# Altium project UKU208.PrjPCB
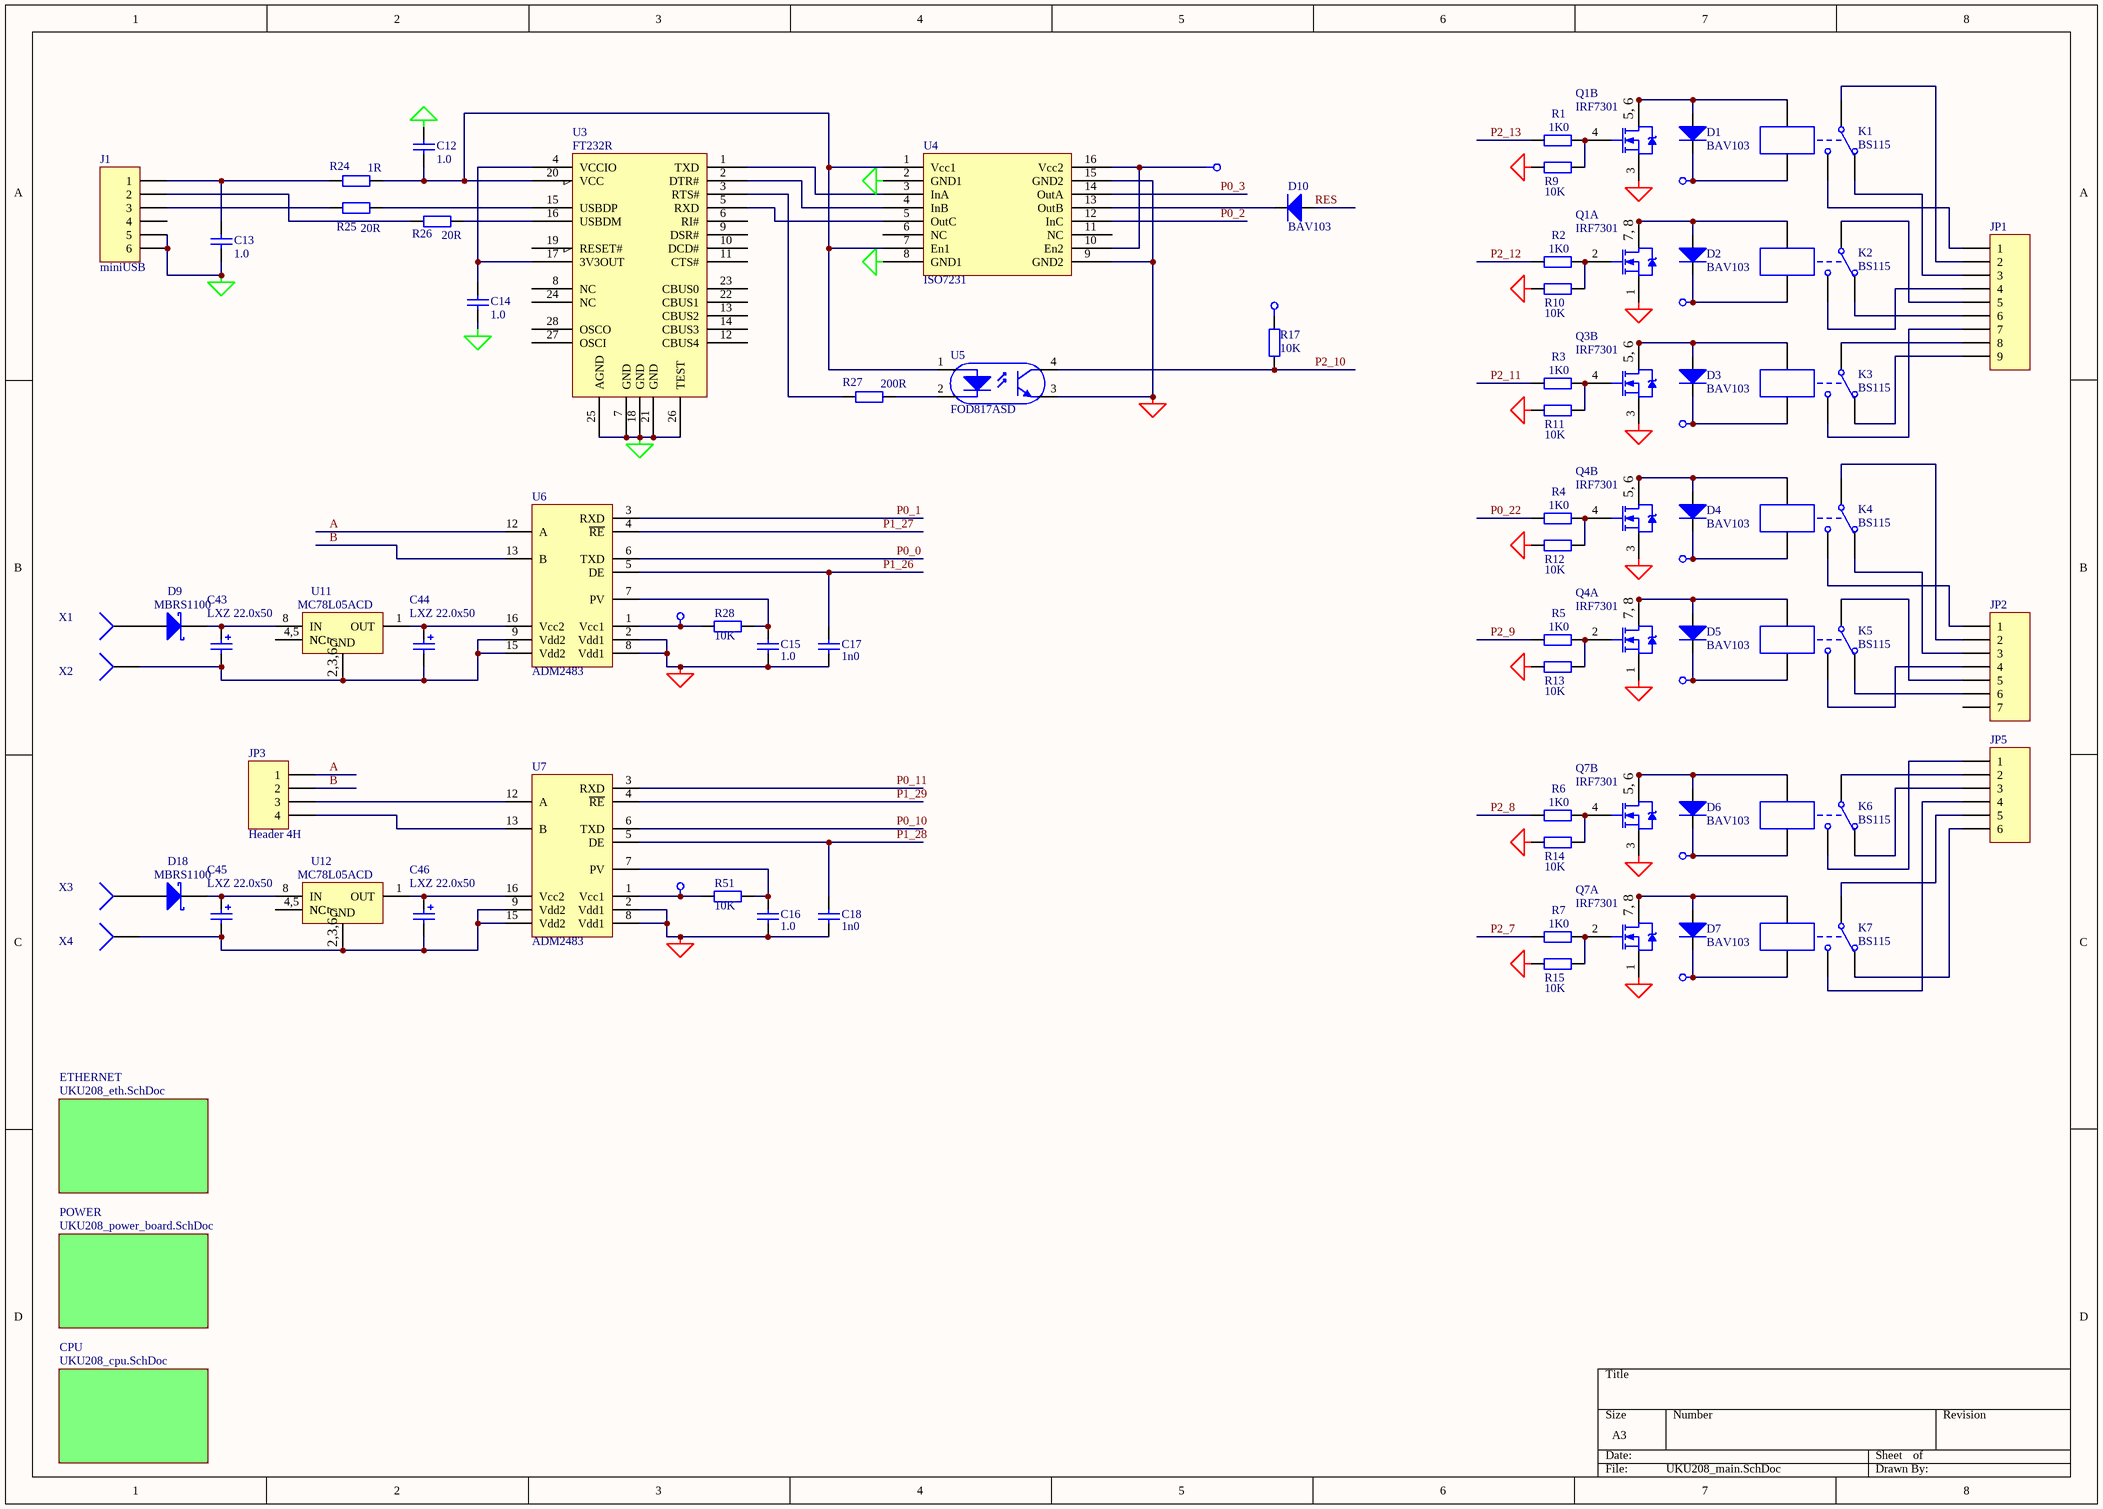
[diagram p0: UKU208_main.SchDoc]
4 sheets, 178 parts. Net scope: global (net labels, ports and power ports of the same name join across sheets).
Board file: UKU208.PcbDoc
Sheets:
  UKU208_main.SchDoc
    POWER = UKU208_power_board.SchDoc
    CPU = UKU208_cpu.SchDoc
    ETHERNET = UKU208_eth.SchDoc

## Sheet UKU208_main.SchDoc
size A3

### Parts
C12  1.0  [_1206]
C13  1.0  [_1206]
C14  1.0  [_1206]
C15  1.0  [_1206]
C16  1.0  [_1206]
C17  1n0  [_1206]
C18  1n0  [_1206]
C43  LXZ 22.0x50  [el3]
C44  LXZ 22.0x50  [el3]
C45  LXZ 22.0x50  [el3]
C46  LXZ 22.0x50  [el3]
D1  BAV103  [_1206d]
D2  BAV103  [_1206d]
D3  BAV103  [_1206d]
D4  BAV103  [_1206d]
D5  BAV103  [_1206d]
D6  BAV103  [_1206d]
D7  BAV103  [_1206d]
D9  MBRS1100  [D_6_3]
D10  BAV103  [_1206d]
D18  MBRS1100  [D_6_3]
J1  miniUSB  [USBmini]
JP1  MHDR1X9  [2EDGR-5.08-9P]  (value not drawn)
JP2  MHDR1X7  [2EDGR-5.08-7P]  (value not drawn)
JP3  Header 4H  [2EDGR-5.08-4P]
JP5  MHDR1X6  [2EDGR-5.08-6P]  (value not drawn)
K1  BS115  [bs115]
K2  BS115  [bs115]
K3  BS115  [bs115]
K4  BS115  [bs115]
K5  BS115  [bs115]
K6  BS115  [bs115]
K7  BS115  [bs115]
Q1  IRF7301  [SO-G8/Y2.2]  (parts A,B of 2)
Q3  IRF7301  [SO-G8/Y2.2]  (part B of 2)
Q4  IRF7301  [SO-G8/Y2.2]  (parts A,B of 2)
Q7  IRF7301  [SO-G8/Y2.2]  (parts A,B of 2)
R1  1K0  [_1206]
R2  1K0  [_1206]
R3  1K0  [_1206]
R4  1K0  [_1206]
R5  1K0  [_1206]
R6  1K0  [_1206]
R7  1K0  [_1206]
R9  10K  [_1206]
R10  10K  [_1206]
R11  10K  [_1206]
R12  10K  [_1206]
R13  10K  [_1206]
R14  10K  [_1206]
R15  10K  [_1206]
R17  10K  [_1206]
R24  1R  [_1206]
R25  20R  [_1206]
R26  20R  [_1206]
R27  200R  [_1206]
R28  10K  [_1206]
R51  10K  [_1206]
U3  FT232R  [SOP65P780-28L]
U4  ISO7231  [SO-G16/D10.4]
U5  FOD817ASD  [FOD817ASD]
U6  ADM2483  [SO-G16/D10.4]
U7  ADM2483  [SO-G16/D10.4]
U11  MC78L05ACD  [SO-G8]
U12  MC78L05ACD  [SO-G8]
X1  (no value)  [PIN1]
X2  (no value)  [PIN1]
X3  (no value)  [PIN1]
X4  (no value)  [PIN1]

### Sub-sheets
CPU = UKU208_cpu.SchDoc: no entries
ETHERNET = UKU208_eth.SchDoc: no entries
POWER = UKU208_power_board.SchDoc: no entries

### Nets
+3v3: R17.2
+5v: D1.2(K) D2.2(K) D3.2(K) D4.2(K) D5.2(K) D6.2(K) D7.2(K) K1.5 K2.5 K3.5 K4.5 K5.5 K6.5 K7.5 R28.1 R51.1 U4.10(En2) U4.16(Vcc2) U6.1(Vcc1) U7.1(Vcc1)
GND: C15.1 C16.1 C17.1 C18.1 Q1.1(S) Q1.3(S) Q3.3(S) Q4.1(S) Q4.3(S) Q7.1(S) Q7.3(S) R9.1 R10.1 R11.1 R12.1 R13.1 R14.1 R15.1 U4.9(GND2) U4.15(GND2) U5.3 U6.2(Vdd1) U6.8(Vdd1) U7.2(Vdd1) U7.8(Vdd1)
GND_USB: C12.1 C13.1 C14.1 J1.5 J1.6 U3.7(GND) U3.18(GND) U3.21(GND) U3.25(AGND) U3.26(TEST) U4.2(GND1) U4.8(GND1)
A: JP3.1 U6.12(A)
B: JP3.2 U6.13(B)
P0_0: U6.6(TXD)
P0_1: U6.3(RXD)
P0_2: U4.12(InC)
P0_3: U4.14(OutA)
P0_10: U7.6(TXD)
P0_11: U7.3(RXD)
P0_22: R4.1
P1_26: C17.2 U6.5(DE)
P1_27: U6.4(~{RE})
P1_28: C18.2 U7.5(DE)
P1_29: U7.4(~{RE})
P2_7: R7.1
P2_8: R6.1
P2_9: R5.1
P2_10: R17.1 U5.4
P2_11: R3.1
P2_12: R2.1
P2_13: R1.1
RES: D10.1(A)
NetC12_2: C12.2 R24.2 U3.20(VCC) U4.1(Vcc1) U4.7(En1) U5.1
NetC13_2: C13.2 J1.1 R24.1
NetC14_2: C14.2 U3.4(VCCIO) U3.17(3V3OUT)
NetC15_2: C15.2 R28.2 U6.7(PV)
NetC16_2: C16.2 R51.2 U7.7(PV)
NetC43_1: C43.1 D9.2(K) U11.8(IN)
NetC43_2: C43.2 C44.2 U6.9(Vdd2) U6.15(Vdd2) U11.2(GND) U11.3(GND) U11.6(GND) U11.7(GND) X2.1
NetC44_1: C44.1 U6.16(Vcc2) U11.1(OUT)
NetC45_1: C45.1 D18.2(K) U12.8(IN)
NetC45_2: C45.2 C46.2 U7.9(Vdd2) U7.15(Vdd2) U12.2(GND) U12.3(GND) U12.6(GND) U12.7(GND) X4.1
NetC46_1: C46.1 U7.16(Vcc2) U12.1(OUT)
NetD1_1: D1.1(A) K1.4 Q1.5(D) Q1.6(D)
NetD2_1: D2.1(A) K2.4 Q1.7(D) Q1.8(D)
NetD3_1: D3.1(A) K3.4 Q3.5(D) Q3.6(D)
NetD4_1: D4.1(A) K4.4 Q4.5(D) Q4.6(D)
NetD5_1: D5.1(A) K5.4 Q4.7(D) Q4.8(D)
NetD6_1: D6.1(A) K6.4 Q7.5(D) Q7.6(D)
NetD7_1: D7.1(A) K7.4 Q7.7(D) Q7.8(D)
NetD9_1: D9.1(A) X1.1
NetD10_2: D10.2(K) U4.13(OutB)
NetD18_1: D18.1(A) X3.1
NetJ1_2: J1.2 R26.1
NetJ1_3: J1.3 R25.1
NetJP1_1: JP1.1 K1.3
NetJP1_2: JP1.2 K1.1
NetJP1_3: JP1.3 K1.2
NetJP1_4: JP1.4 K2.3
NetJP1_5: JP1.5 K2.1
NetJP1_6: JP1.6 K2.2
NetJP1_7: JP1.7 K3.3
NetJP1_8: JP1.8 K3.1
NetJP1_9: JP1.9 K3.2
NetJP2_1: JP2.1 K4.3
NetJP2_2: JP2.2 K4.1
NetJP2_3: JP2.3 K4.2
NetJP2_4: JP2.4 K5.3
NetJP2_5: JP2.5 K5.1
NetJP2_6: JP2.6 K5.2
NetJP3_3: JP3.3 U7.12(A)
NetJP3_4: JP3.4 U7.13(B)
NetJP5_1: JP5.1 K6.3
NetJP5_2: JP5.2 K6.1
NetJP5_3: JP5.3 K6.2
NetJP5_4: JP5.4 K7.3
NetJP5_5: JP5.5 K7.1
NetJP5_6: JP5.6 K7.2
NetQ1_2: Q1.2(G) R2.2 R10.2
NetQ1_4: Q1.4(G) R1.2 R9.2
NetQ3_4: Q3.4(G) R3.2 R11.2
NetQ4_2: Q4.2(G) R5.2 R13.2
NetQ4_4: Q4.4(G) R4.2 R12.2
NetQ7_2: Q7.2(G) R7.2 R15.2
NetQ7_4: Q7.4(G) R6.2 R14.2
NetR25_2: R25.2 U3.15(USBDP)
NetR26_2: R26.2 U3.16(USBDM)
NetR27_1: R27.1 U3.3(RTS#)
NetR27_2: R27.2 U5.2
NetU3_1: U3.1(TXD) U4.3(InA)
NetU3_2: U3.2(DTR#) U4.4(InB)
NetU3_5: U3.5(RXD) U4.5(OutC)
NetU11_4: U11.4(NC) U11.5(NC)
NetU12_4: U12.4(NC) U12.5(NC)

Not connected (* = marked no-connect by the designer): J1 4; JP2 7; U3 6(RI#) 8(NC) 9(DSR#) 10(DCD#) 11(CTS#) 12(CBUS4) 13(CBUS2) 14(CBUS3) 19(RESET#) 22(CBUS1) 23(CBUS0) 24(NC) 27(OSCI) 28(OSCO); U4 6(NC) 11(NC)

### Notes on the sheet
- (in symbol IRF7301, part A) 7, 8
- (in symbol IRF7301, part B) 5, 6
- (in symbol MC78L05ACD) 4,5; 2,3,6,7

### Library data of the parts
C12-C18 = Cap Semi: Capacitor (Semiconductor SIM Model); Manufacturer: Generic Components; Class I: Passive; Value: 1,0; Published: 8-Jun-2000; Revision: July-2002: Re-released for DXP Platform.; Publisher: Altium Limited; Class II: Capacitor
C43-C46 = Cap Pol1: Polarized Capacitor (Radial); Manufacturer: Generic Components; Class I: Passive; Value: 22,0x50; Published: 8-Jun-2000; Revision: July-2002: Re-released for DXP Platform.; Publisher: Altium Limited; Class II: Capacitor
D1-D7 D10 = Diode: Manufacturer: Generic Components; Class I: Discrete; Class II: Diode - Switching; Value: LL4148; Published: 8-Jun-2000; Revision: July-2002: Re-released for DXP Platform.; Publisher: Altium Limited
D9 D18 = 10BQ015: Schottky Rectifier; Manufacturer: International Rectifier; Revision 1: 10-July-2000: SIM Model Added.; Revision 2: July-2002: Re-released for DXP Platform.; Class I: Discrete; Class II: Rectifier - Schottky; Published: 8-Jun-2000; Datasheet: Latest Revision: PD-2.396A; Package Reference: DO-214AA; Publisher: Altium Limited
J1 = Header 6: Header, 6-Pin; Value: USB-B; LatestRevisionDate: 17-Jul-2002; LatestRevisionNote: Re-released for DXP Platform.; Publisher: Altium Limited
JP1 = MHDR1X9: Header, 9-Pin; Manufacturer: Generic Components; Class I: Connector; Revision: July-2002: Re-released for DXP Platform.; Publisher: Altium Limited
JP2 = MHDR1X7: Header, 7-Pin; Manufacturer: Generic Components; Class I: Connector; Revision: July-2002: Re-released for DXP Platform.; Publisher: Altium Limited
JP3 = Header 4H: Header, 4-Pin,  Right Angle; Manufacturer: Generic Components; Class I: Connector; Revision: July-2002: Re-released for DXP Platform.; Publisher: Altium Limited
JP5 = MHDR1X6: Header, 6-Pin; Manufacturer: Generic Components; Class I: Connector; Revision: July-2002: Re-released for DXP Platform.; Publisher: Altium Limited
K1-K7 = BS115: Single-Pole Dual-Throw Relay; Manufacturer: Generic Components; Class I: Electro-mechanical; Published: 24-Mar-1999; Revision: July-2002: Re-released for DXP Platform.; Publisher: Altium Limited; Class II: Relay
Q1 Q3 Q4 Q7 = IRF7301: FET; Manufacturer: International Rectifier; Revision 1: 29-Sep-2000: Re-orientated a 'Drain' pin on first part.; Revision 2: July-2002: Re-released for DXP Platform.; Class I: Discrete; Class II: MOSFET - Power; Value: IRF7103; Published: 8-Jun-2000; Datasheet: Latest Revision: Aug-1997; Package Reference: SOIC8; Publisher: Altium Limited
R1-R7 = Res2: Resistor; Manufacturer: Generic Components; Class I: Passive; Rule: Undefined; Published: 8-Jun-2000; Revision: July-2002: Re-released for DXP Platform.; Publisher: Altium Limited; Class II: Resistor; Value: 1K0
R9-R15 = Res2: Resistor; Manufacturer: Generic Components; Class I: Passive; Published: 8-Jun-2000; Revision: July-2002: Re-released for DXP Platform.; Publisher: Altium Limited; Class II: Resistor; Value: 10K
R17 R28 R51 = Res2: Resistor; Manufacturer: Generic Components; Class I: Passive; Value: 1K0; Rule: Undefined; Published: 8-Jun-2000; Revision: July-2002: Re-released for DXP Platform.; Publisher: Altium Limited; Class II: Resistor
R24-R27 = RES: Body: 0603; Value: 22R; Type: S; Pins: 2
U3 = FT232R: Body: SSOP28LD; Value: FT232RL; Type: S; Pins: 20
U5 = F00817ASD
U11 U12 = MC78L05ACD: 3-Terminal Low-Current Positive Fixed Voltage Regulator; Manufacturer: Motorola; Class I: Power Management; Published: 15-Apr-2002; Datasheet: Linear and Interface Integrated Circuits, DL128 Rev2 (1988); Package Reference: 751-02; Publisher: Altium Limited; Class II: Voltage Regulator
X1-X4 = Socket: Manufacturer: Generic Components; Class I: Connector; Revision: July-2002: Re-released for DXP Platform.; Publisher: Altium Limited

## Sheet UKU208_power_board.SchDoc
size A3
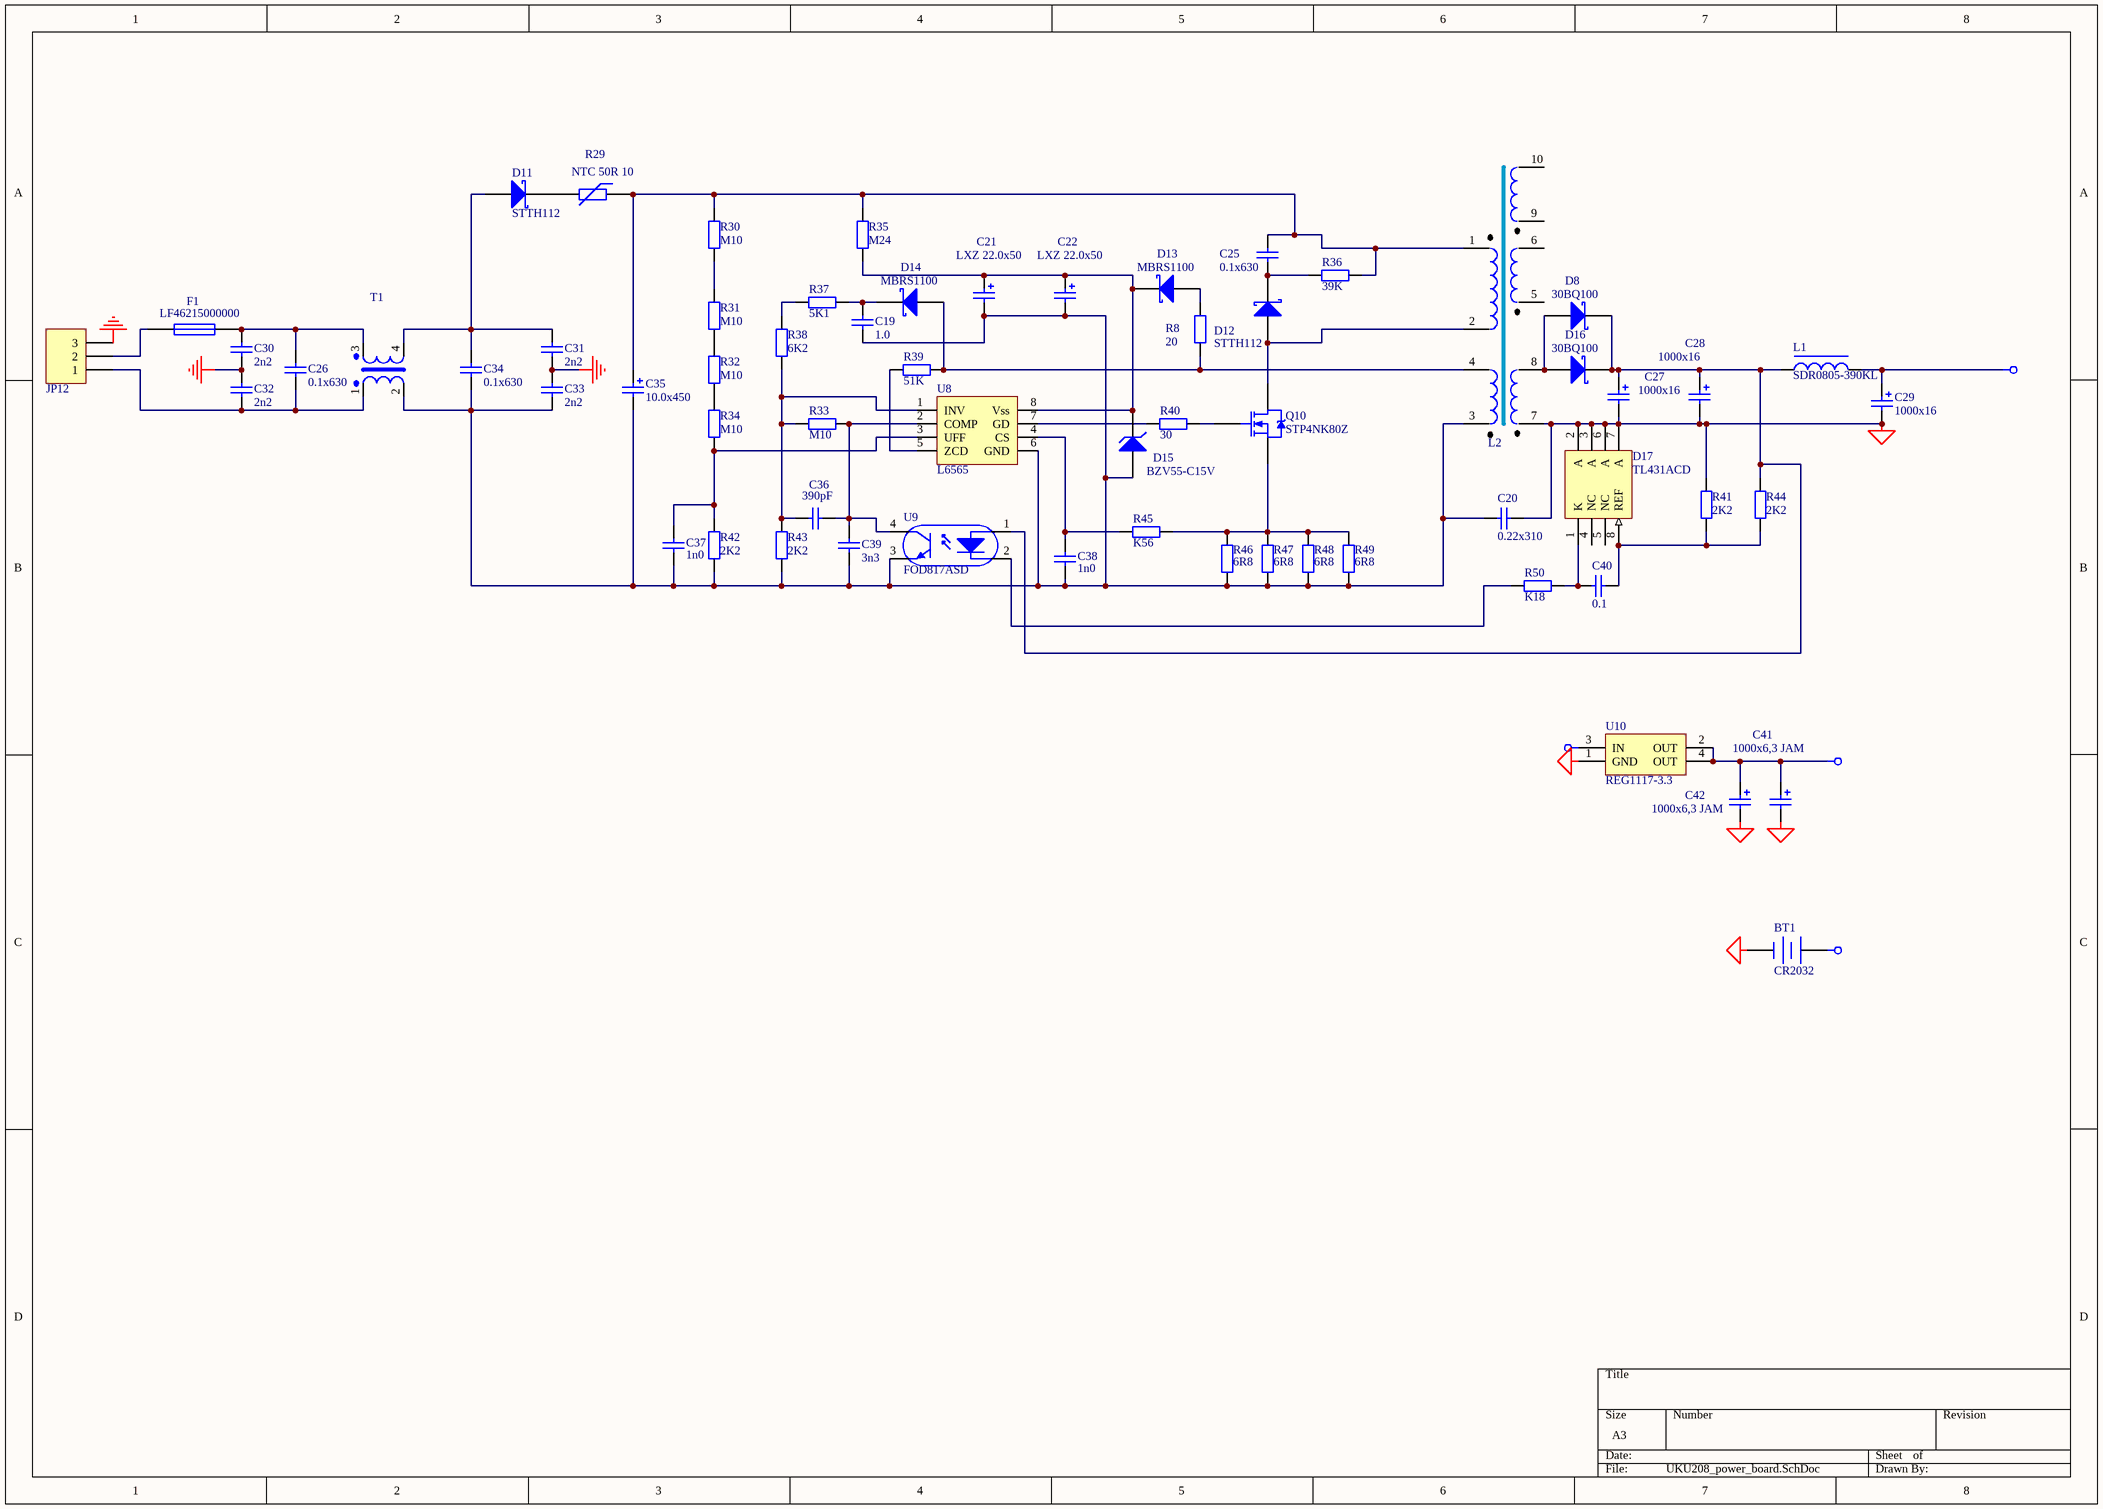
[diagram p1: UKU208_power_board.SchDoc]

### Parts
BT1  CR2032  [BAT_SUPP]
C19  1.0  [_1206]
C20  0.22x310  [C8]
C21  LXZ 22.0x50  [el3]
C22  LXZ 22.0x50  [el3]
C25  0.1x630  [c15]
C26  0.1x630  [c15]
C27  1000x16  [el5]
C28  1000x16  [el5]
C29  1000x16  [el5]
C30  2n2  [C8]
C31  2n2  [c8]
C32  2n2  [c8]
C33  2n2  [c8]
C34  0.1x630  [c15]
C35  10.0x450  [el_15_25_h]
C36  390pF  [_1206]
C37  1n0  [_1206]
C38  1n0  [_1206]
C39  3n3  [_1206]
C40  0.1  [_1206]
C41  1000x6,3 JAM  [el3]
C42  1000x6,3 JAM  [el3]
D8  30BQ100  [30BQ100]
D11  STTH112  [D_6_3]
D12  STTH112  [D_6_3]
D13  MBRS1100  [D_6_3]
D14  MBRS1100  [D_6_3]
D15  BZV55-C15V  [_1206d]
D16  30BQ100  [30BQ100]
D17  TL431ACD  [SO-G8]
F1  LF46215000000  [LF462]
JP12  Header 3  [2EDGR-5.08-3P]  (value not drawn)
L1  SDR0805-390KL  [L10x10]
L2  L220-K10  [trans_ring1]  (value not drawn)
Q10  STP4NK80Z  [TO220_h]
R8  20  [_1206]
R29  NTC 50R 10  [JVR07N]
R30  M10  [_1206]
R31  M10  [_1206]
R32  M10  [_1206]
R33  M10  [_1206]
R34  M10  [_1206]
R35  M24  [AXIAL-0.7]
R36  39K  [AXIAL-0.7]
R37  5K1  [_1206]
R38  6K2  [_1206]
R39  51K  [_1206]
R40  30  [_1206]
R41  2K2  [_1206]
R42  2K2  [_1206]
R43  2K2  [_1206]
R44  2K2  [_1206]
R45  K56  [_1206]
R46  6R8  [_1206]
R47  6R8  [_1206]
R48  6R8  [_1206]
R49  6R8  [_1206]
R50  K18  [_1206]
T1  TRANS1_1  [3030R4]  (value not drawn)
U8  L6565  [so-g8]
U9  FOD817ASD  [FOD817ASD]
U10  REG1117-3.3  [DSO-G3]

### Nets
+3v3: C41.1 C42.1 U10.2(OUT) U10.4(OUT)
+5v: C29.1 L1.2 U10.3(IN)
+Vbat: BT1.1(+)
GND: BT1.2(-) C20.1 C27.2 C28.2 C29.2 C41.2 C42.2 D17.2(A) D17.3(A) D17.6(A) D17.7(A) L2.7 R41.2 U10.1(GND)
GND_GND: C30.1 C31.1 C32.2 C33.2 JP12.3
NetC19_1: C19.1 C20.2 C21.2 C22.2 C33.1 C34.1 C35.2 C37.2 C38.2 C39.1 D15.1(A) L2.3 R42.1 R43.1 R46.2 R47.2 R48.2 R49.2 T1.2(Pri-) U8.6(GND) U9.3
NetC19_2: C19.2 D14.2(K) R37.1
NetC21_1: C21.1 C22.1 D13.2(K) D15.2(K) R35.1 U8.8(Vss)
NetC25_1: C25.1 D12.2(K) R36.2
NetC25_2: C25.2 C35.1 L2.1 R29.1 R30.2 R35.2 R36.1
NetC26_1: C26.1 C32.1 JP12.1 T1.1(Pri+)
NetC26_2: C26.2 C30.2 F1.1 T1.3(Sec1+)
NetC27_1: C27.1 C28.1 D8.2(K) D16.2(K) L1.1 R44.1 U9.1
NetC31_2: C31.2 C34.2 D11.1(A) T1.4(Sec1-)
NetC36_1: C36.1 R33.2 R38.1 R43.2 U8.1(INV)
NetC36_2: C36.2 C39.2 R33.1 U8.2(COMP) U9.4
NetC37_1: C37.1 R34.1 R42.2 U8.3(UFF)
NetC38_1: C38.1 R45.2 U8.4(CS)
NetC40_1: C40.1 D17.8(REF) R41.1 R44.2
NetC40_2: C40.2 D17.1(K) R50.1
NetD8_1: D8.1(A) D16.1(A) L2.8
NetD11_2: D11.2(K) R29.2
NetD12_1: D12.1(A) L2.2 Q10.2(D)
NetD13_1: D13.1(A) R8.1
NetD14_1: D14.1(A) L2.4 R8.2 R39.1
NetF1_2: F1.2 JP12.2
NetQ10_1: Q10.1(G) R40.1
NetQ10_3: Q10.3(S) R45.1 R46.1 R47.1 R48.1 R49.1
NetR30_1: R30.1 R31.2
NetR31_1: R31.1 R32.2
NetR32_1: R32.1 R34.2
NetR37_2: R37.2 R38.2
NetR39_2: R39.2 U8.5(ZCD)
NetR40_2: R40.2 U8.7(GD)
NetR50_2: R50.2 U9.2

Not connected (* = marked no-connect by the designer): D17 4(NC) 5(NC); L2 5 6 9 10

### Library data of the parts
BT1 = Battery: Multicell Battery; Manufacturer: Generic Components; Published: 24-Mar-1999; Revision: July-2002: Re-released for DXP Platform.; Publisher: Altium Limited
C19 C20 C25 C26 C30-C34 C36-C40 = Cap Semi: as C12 on sheet UKU208_main; Published: 8-Jun-2000; Revision: July-2002: Re-released for DXP Platform.; Publisher: Altium Limited; Class II: Capacitor
C21 C22 C27-C29 C35 C41 C42 = Cap Pol1: as C43 on sheet UKU208_main; Published: 8-Jun-2000; Revision: July-2002: Re-released for DXP Platform.; Publisher: Altium Limited; Class II: Capacitor
D8 D13 D14 D16 = 10BQ015: as D9 on sheet UKU208_main; Published: 8-Jun-2000; Datasheet: Latest Revision: PD-2.396A; Package Reference: DO-214AA; Publisher: Altium Limited
D11 D12 = 10BQ015: Schottky Diode; Manufacturer: International Rectifier; Revision 1: 10-July-2000: SIM Model Added.; Revision 2: July-2002: Re-released for DXP Platform.; Class I: Discrete; Class II: Rectifier - Schottky; Value: 10BQ100; Published: 8-Jun-2000; Datasheet: Latest Revision: PD-2.396A; Package Reference: DO-214AA; Publisher: Altium Limited
D15 = D Zener: Zener Diode; Manufacturer: Generic Components; Class I: Discrete; Class II: Diode - Zener; Value: BZV55C5V6; Published: 8-Jun-2000; Revision: July-2002: Re-released for DXP Platform.; Publisher: Altium Limited
D17 = TL431ACD: Programmable Precision Reference; Manufacturer: Motorola; Class I: Power Management; Class II: Voltage Reference; Published: 15-Apr-2002; Datasheet: Linear and Interface Integrated Circuits, DL128 Rev2 (1988); Package Reference: 751-02; Publisher: Altium Limited
F1 = Fuse 1: Fuse; Manufacturer: Generic Components; Class I: Passive; Published: 8-Jun-2000; Revision: July-2002: Re-released for DXP Platform.; Publisher: Altium Limited; Class II: Fuse
JP12 = Header 3: Header, 3-Pin; Manufacturer: Generic Components; Class I: Connector; Revision: July-2002: Re-released for DXP Platform.; Publisher: Altium Limited
L1 = Inductor Konstr 2: Magnetic-Core Inductor; Manufacturer: Generic Components; Class I: Passive; Published: 24-Mar-1999; Revision: July-2002: Re-released for DXP Platform.; Publisher: Altium Limited; Class II: Inductor
L2 = L1_dc_2: Дроссель
Q10 = NMOS-2: N-Channel Power MOSFET; Manufacturer: Generic Components; Class I: Discrete; Class II: MOSFET - Power; Note: Pin 2 is electrically connected to pin 4.; Published: 8-Jun-2000; Revision: July-2002: Re-released for DXP Platform.; Datasheet: Latest Revision: PD-9.814; Package Reference: TO-220AB; Publisher: Altium Limited
R8 R30-R50 = Res2: as R17 on sheet UKU208_main; Published: 8-Jun-2000; Revision: July-2002: Re-released for DXP Platform.; Publisher: Altium Limited; Class II: Resistor
R29 = Res Varistor: Varistor (Voltage-Sensitive Resistor); Manufacturer: Generic Components; Class I: Discrete; Published: 24-Mar-1999; Revision: July-2002: Re-released for DXP Platform.; Publisher: Altium Limited; Class II: Voltage-Sensitive Resistor
T1 = TRANS1_1: Manufacturer: Generic Components; Class I: Passive; Class II: Transformer; Published: 25-Jan-2001; Revision: July-2002: Re-released for DXP Platform.; Publisher: Altium Limited
U9 = F00817ASD
U10 = REG1117-3.3: 800mA and 1A Low Dropout Positive Regulator 2.85V, 3.3V, 5V, and Adjustable; Manufacturer: Burr-Brown; Package Information: Latest Revision: Rev. C; Class I: Power Management; Class II: Voltage Regulator; Published: 8-Jun-2000; Revision: July-2002: Re-released for DXP Platform.; Datasheet: Latest Revision: Sep-1997; Package Reference: ZZ311; Publisher: Altium Limited

## Sheet UKU208_cpu.SchDoc
size A3
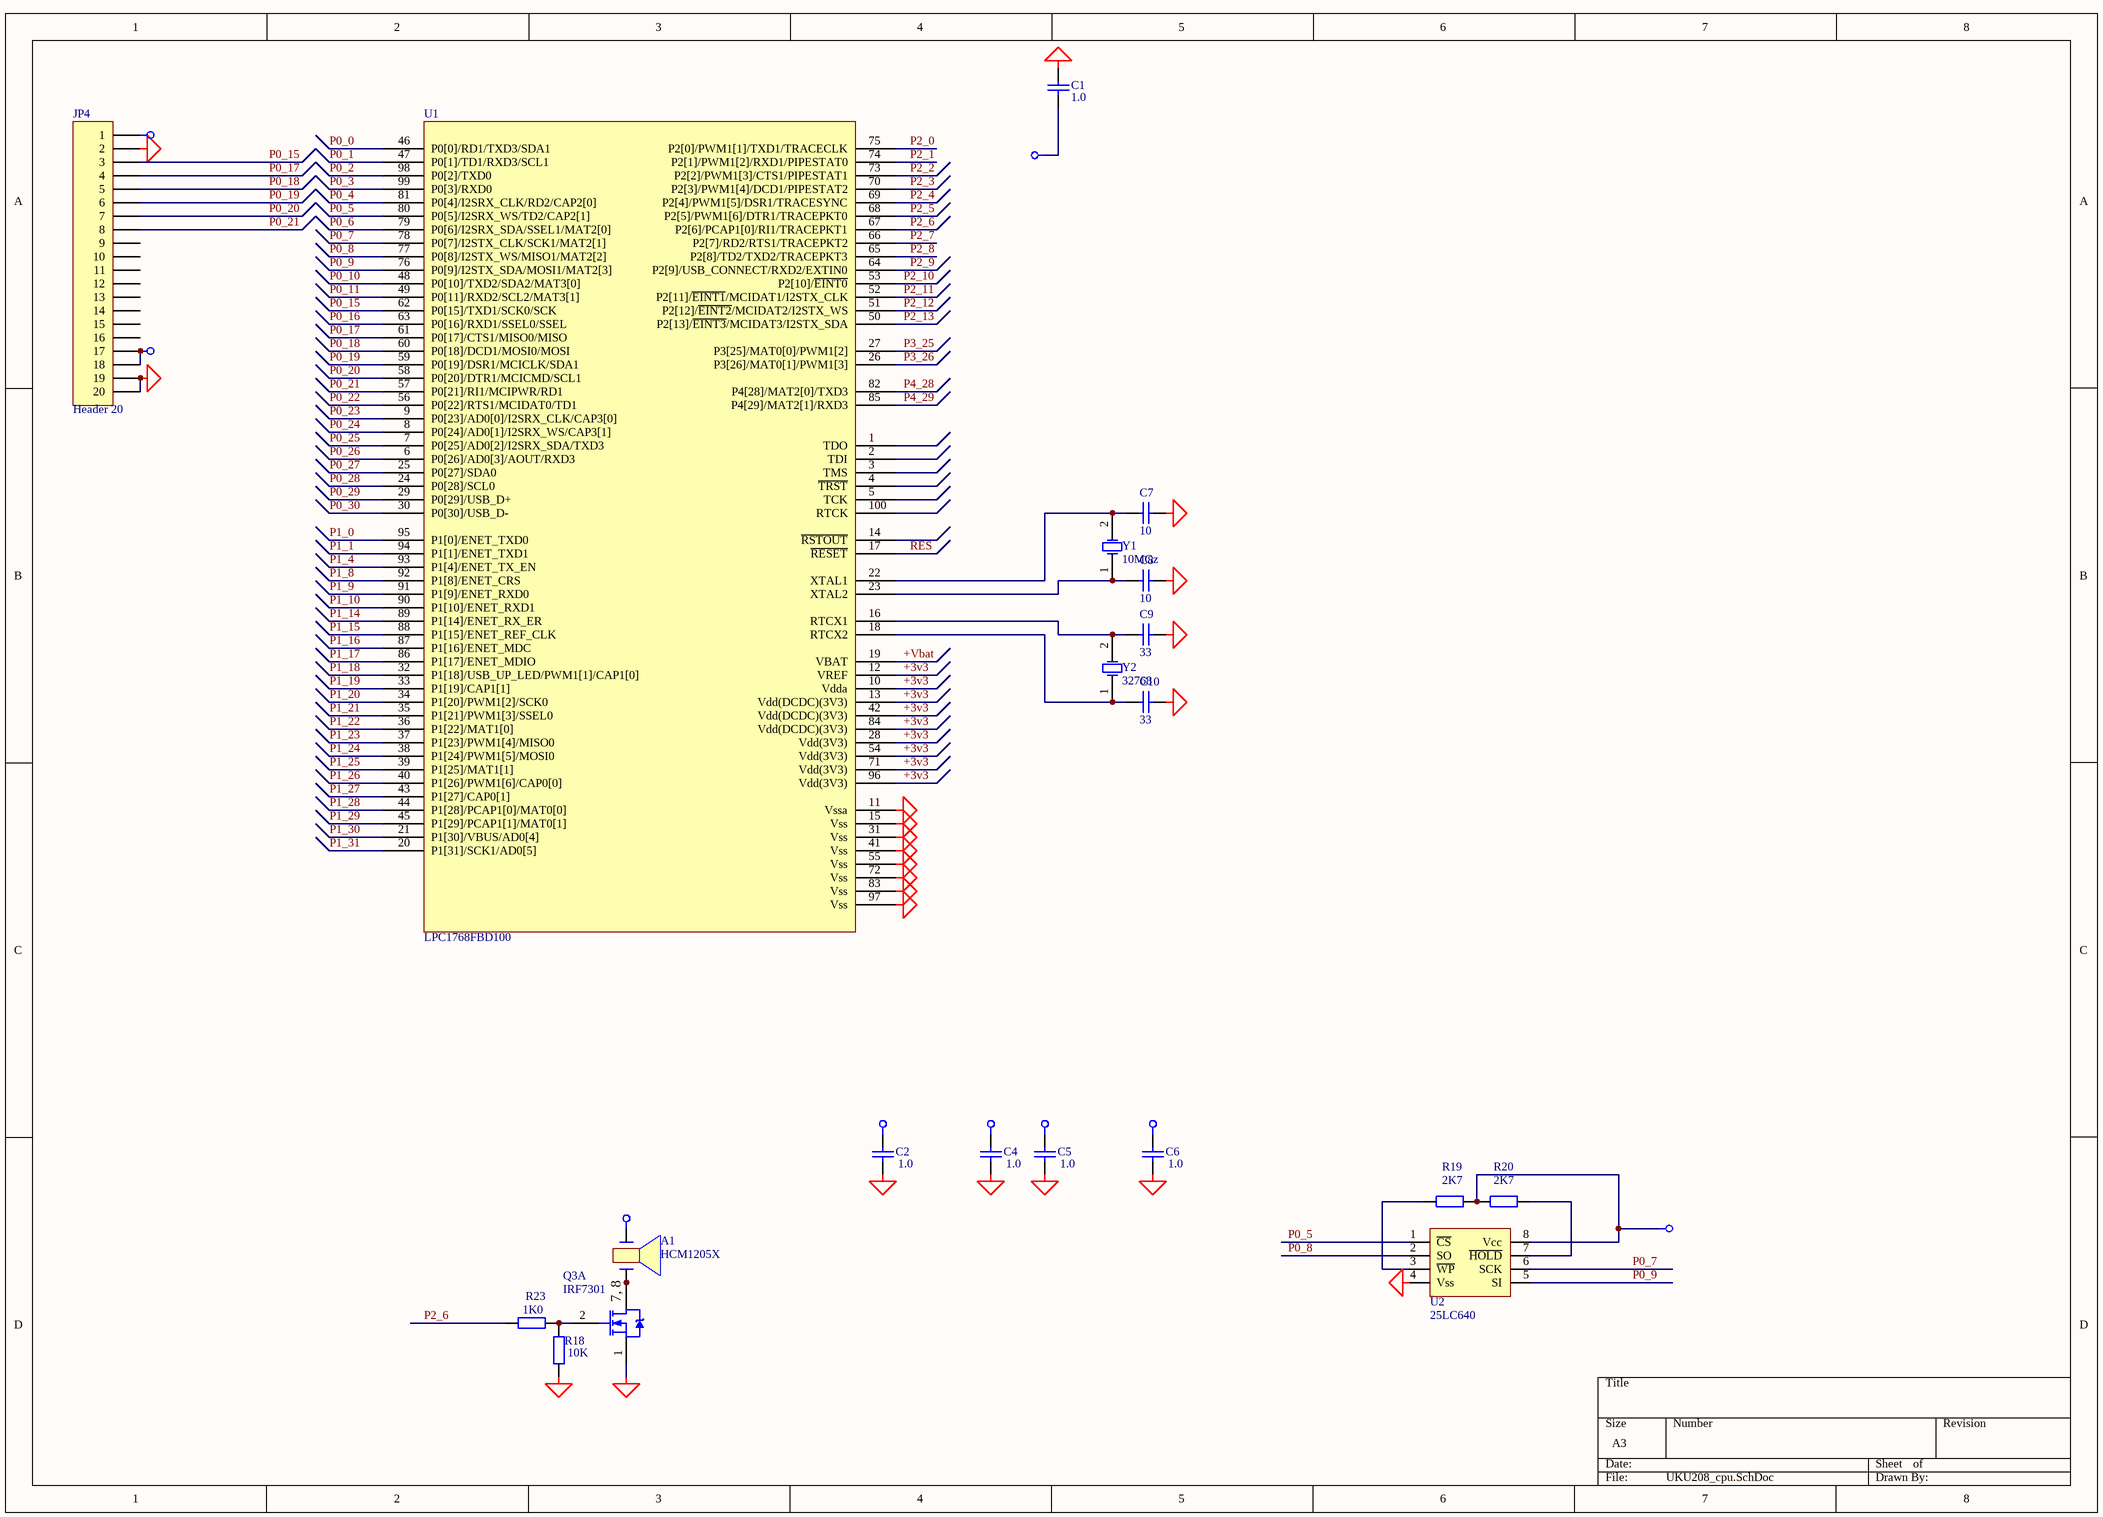
[diagram p2: UKU208_cpu.SchDoc]

### Parts
A1  HCM1205X  [zumm]
C1  1.0  [_1206]
C2  1.0  [_1206]
C4  1.0  [_1206]
C5  1.0  [_1206]
C6  1.0  [_1206]
C7  10  [_1206]
C8  10  [_1206]
C9  33  [_1206]
C10  33  [_1206]
JP4  Header 20  [XF2M20151A]
Q3  IRF7301  [SO-G8/Y2.2]  (part A of 2)
R18  10K  [_1206]
R19  2K7  [_1206]
R20  2K7  [_1206]
R23  1K0  [_1206]
U1  LPC1768FBD100  [LPC2368]
U2  25LC640  [SO-G8/D5]
Y1  10MGz  [QWARZ1]
Y2  32768  [QWARZ2]

### Nets
+3v3: C1.1 C5.2 JP4.1 U1.10(Vdda) U1.12(VREF) U1.13(Vdd(DCDC)(3V3)) U1.28(Vdd(3V3)) U1.42(Vdd(DCDC)(3V3)) U1.54(Vdd(3V3)) U1.71(Vdd(3V3)) U1.84(Vdd(DCDC)(3V3)) U1.96(Vdd(3V3))
+5v: A1.1 C2.2 C4.2 C6.2 JP4.17 JP4.18 R19.2 R20.1 U2.8(Vcc)
+Vbat: U1.19(VBAT)
GND: C1.2 C2.1 C4.1 C5.1 C6.1 C7.1 C8.1 C9.1 C10.1 JP4.2 JP4.19 JP4.20 Q3.1(S) R18.1 U1.11(Vssa) U1.15(Vss) U1.31(Vss) U1.41(Vss) U1.55(Vss) U1.72(Vss) U1.83(Vss) U1.97(Vss) U2.4(Vss)
P0_0: U1.46(P0[0]/RD1/TXD3/SDA1)
P0_1: U1.47(P0[1]/TD1/RXD3/SCL1)
P0_2: U1.98(P0[2]/TXD0)
P0_3: U1.99(P0[3]/RXD0)
P0_4: U1.81(P0[4]/I2SRX_CLK/RD2/CAP2[0])
P0_5: U1.80(P0[5]/I2SRX_WS/TD2/CAP2[1]) U2.1(~{CS})
P0_6: U1.79(P0[6]/I2SRX_SDA/SSEL1/MAT2[0])
P0_7: U1.78(P0[7]/I2STX_CLK/SCK1/MAT2[1]) U2.6(SCK)
P0_8: U1.77(P0[8]/I2STX_WS/MISO1/MAT2[2]) U2.2(SO)
P0_9: U1.76(P0[9]/I2STX_SDA/MOSI1/MAT2[3]) U2.5(SI)
P0_10: U1.48(P0[10]/TXD2/SDA2/MAT3[0])
P0_11: U1.49(P0[11]/RXD2/SCL2/MAT3[1])
P0_15: JP4.3 U1.62(P0[15]/TXD1/SCK0/SCK)
P0_16: U1.63(P0[16]/RXD1/SSEL0/SSEL)
P0_17: JP4.4 U1.61(P0[17]/CTS1/MISO0/MISO)
P0_18: JP4.5 U1.60(P0[18]/DCD1/MOSI0/MOSI)
P0_19: JP4.6 U1.59(P0[19]/DSR1/MCICLK/SDA1)
P0_20: JP4.7 U1.58(P0[20]/DTR1/MCICMD/SCL1)
P0_21: JP4.8 U1.57(P0[21]/RI1/MCIPWR/RD1)
P0_22: U1.56(P0[22]/RTS1/MCIDAT0/TD1)
P0_23: U1.9(P0[23]/AD0[0]/I2SRX_CLK/CAP3[0])
P0_24: U1.8(P0[24]/AD0[1]/I2SRX_WS/CAP3[1])
P0_25: U1.7(P0[25]/AD0[2]/I2SRX_SDA/TXD3)
P0_26: U1.6(P0[26]/AD0[3]/AOUT/RXD3)
P0_27: U1.25(P0[27]/SDA0)
P0_28: U1.24(P0[28]/SCL0)
P0_29: U1.29(P0[29]/USB_D+)
P0_30: U1.30(P0[30]/USB_D-)
P1_0: U1.95(P1[0]/ENET_TXD0)
P1_1: U1.94(P1[1]/ENET_TXD1)
P1_4: U1.93(P1[4]/ENET_TX_EN)
P1_8: U1.92(P1[8]/ENET_CRS)
P1_9: U1.91(P1[9]/ENET_RXD0)
P1_10: U1.90(P1[10]/ENET_RXD1)
P1_14: U1.89(P1[14]/ENET_RX_ER)
P1_15: U1.88(P1[15]/ENET_REF_CLK)
P1_16: U1.87(P1[16]/ENET_MDC)
P1_17: U1.86(P1[17]/ENET_MDIO)
P1_18: U1.32(P1[18]/USB_UP_LED/PWM1[1]/CAP1[0])
P1_19: U1.33(P1[19]/CAP1[1])
P1_20: U1.34(P1[20]/PWM1[2]/SCK0)
P1_21: U1.35(P1[21]/PWM1[3]/SSEL0)
P1_22: U1.36(P1[22]/MAT1[0])
P1_23: U1.37(P1[23]/PWM1[4]/MISO0)
P1_24: U1.38(P1[24]/PWM1[5]/MOSI0)
P1_25: U1.39(P1[25]/MAT1[1])
P1_26: U1.40(P1[26]/PWM1[6]/CAP0[0])
P1_27: U1.43(P1[27]/CAP0[1])
P1_28: U1.44(P1[28]/PCAP1[0]/MAT0[0])
P1_29: U1.45(P1[29]/PCAP1[1]/MAT0[1])
P1_30: U1.21(P1[30]/VBUS/AD0[4])
P1_31: U1.20(P1[31]/SCK1/AD0[5])
P2_0: U1.75(P2[0]/PWM1[1]/TXD1/TRACECLK)
P2_1: U1.74(P2[1]/PWM1[2]/RXD1/PIPESTAT0)
P2_2: U1.73(P2[2]/PWM1[3]/CTS1/PIPESTAT1)
P2_3: U1.70(P2[3]/PWM1[4]/DCD1/PIPESTAT2)
P2_4: U1.69(P2[4]/PWM1[5]/DSR1/TRACESYNC)
P2_5: U1.68(P2[5]/PWM1[6]/DTR1/TRACEPKT0)
P2_6: R23.1 U1.67(P2[6]/PCAP1[0]/RI1/TRACEPKT1)
P2_7: U1.66(P2[7]/RD2/RTS1/TRACEPKT2)
P2_8: U1.65(P2[8]/TD2/TXD2/TRACEPKT3)
P2_9: U1.64(P2[9]/USB_CONNECT/RXD2/EXTIN0)
P2_10: U1.53(P2[10]/~{EINT0})
P2_11: U1.52(P2[11]/~{EINT1}/MCIDAT1/I2STX_CLK)
P2_12: U1.51(P2[12]/~{EINT2}/MCIDAT2/I2STX_WS)
P2_13: U1.50(P2[13]/~{EINT3}/MCIDAT3/I2STX_SDA)
P3_25: U1.27(P3[25]/MAT0[0]/PWM1[2])
P3_26: U1.26(P3[26]/MAT0[1]/PWM1[3])
P4_28: U1.82(P4[28]/MAT2[0]/TXD3)
P4_29: U1.85(P4[29]/MAT2[1]/RXD3)
RES: U1.17(~{RESET})
NetA1_2: A1.2 Q3.7(D) Q3.8(D)
NetC7_2: C7.2 U1.22(XTAL1) Y1.2(OSC2)
NetC8_2: C8.2 U1.23(XTAL2) Y1.1(OSC1)
NetC9_2: C9.2 U1.16(RTCX1) Y2.2(OSC2)
NetC10_2: C10.2 U1.18(RTCX2) Y2.1(OSC1)
NetQ3_2: Q3.2(G) R18.2 R23.2
NetR19_1: R19.1 U2.3(~{WP})
NetR20_2: R20.2 U2.7(~{HOLD})

Not connected (* = marked no-connect by the designer): JP4 9 10 11 12 13 14 15 16; U1 1(TDO) 2(TDI) 3(TMS) 4(~{TRST}) 5(TCK) 14(~{RSTOUT}) 100(RTCK)

### Notes on the sheet
- (in symbol IRF7301, part A) 7, 8

### Library data of the parts
A1 = PJEZ0: Beeper; Value: EFM260
C1 = Cap Semi: Capacitor; Manufacturer: Generic Components; Class I: Passive; Value: 1,0; Published: 8-Jun-2000; Revision: July-2002: Re-released for DXP Platform.; Publisher: Altium Limited; Class II: Capacitor
C2 C4-C6 = Cap Semi: Capacitor; Manufacturer: Generic Components; Class I: Passive; Value: 0,1; Published: 8-Jun-2000; Revision: July-2002: Re-released for DXP Platform.; Publisher: Altium Limited; Class II: Capacitor
C7 C8 = Cap Semi: Capacitor; Manufacturer: Generic Components; Class I: Passive; Value: 15pF; Published: 8-Jun-2000; Revision: July-2002: Re-released for DXP Platform.; Publisher: Altium Limited; Class II: Capacitor
C9 C10 = Cap Semi: Capacitor (Semiconductor SIM Model); Manufacturer: Generic Components; Class I: Passive; Value: 15pF; Published: 8-Jun-2000; Revision: July-2002: Re-released for DXP Platform.; Publisher: Altium Limited; Class II: Capacitor
JP4 = Header 20: Header, 20-Pin; Manufacturer: Generic Components; Class I: Connector; Revision: July-2002: Re-released for DXP Platform.; Publisher: Altium Limited
Q3 = IRF7301: as Q1 on sheet UKU208_main; Published: 8-Jun-2000; Datasheet: Latest Revision: Aug-1997; Package Reference: SOIC8; Publisher: Altium Limited
R18 = Res2: as R9 on sheet UKU208_main; Published: 8-Jun-2000; Revision: July-2002: Re-released for DXP Platform.; Publisher: Altium Limited; Class II: Resistor; Value: 10K
R19 R20 R23 = Res2: as R1 on sheet UKU208_main; Published: 8-Jun-2000; Revision: July-2002: Re-released for DXP Platform.; Publisher: Altium Limited; Class II: Resistor
  R19 R20: Value: 2K7
  R23: Value: 1K0
U1 = LPC2368FBD100
U2 = 25LC640: Memory; Value: 26LC640
Y1 Y2 = XTAL: Crystal Oscillator; Manufacturer: Generic Components; Published: 8-Jun-2000; Revision: July-2002: Re-released for DXP Platform.; Publisher: Altium Limited; Class I: Oscillator; Class II: Crystal Oscillator
  Y1: Value: 10MGz

## Sheet UKU208_eth.SchDoc
size A3
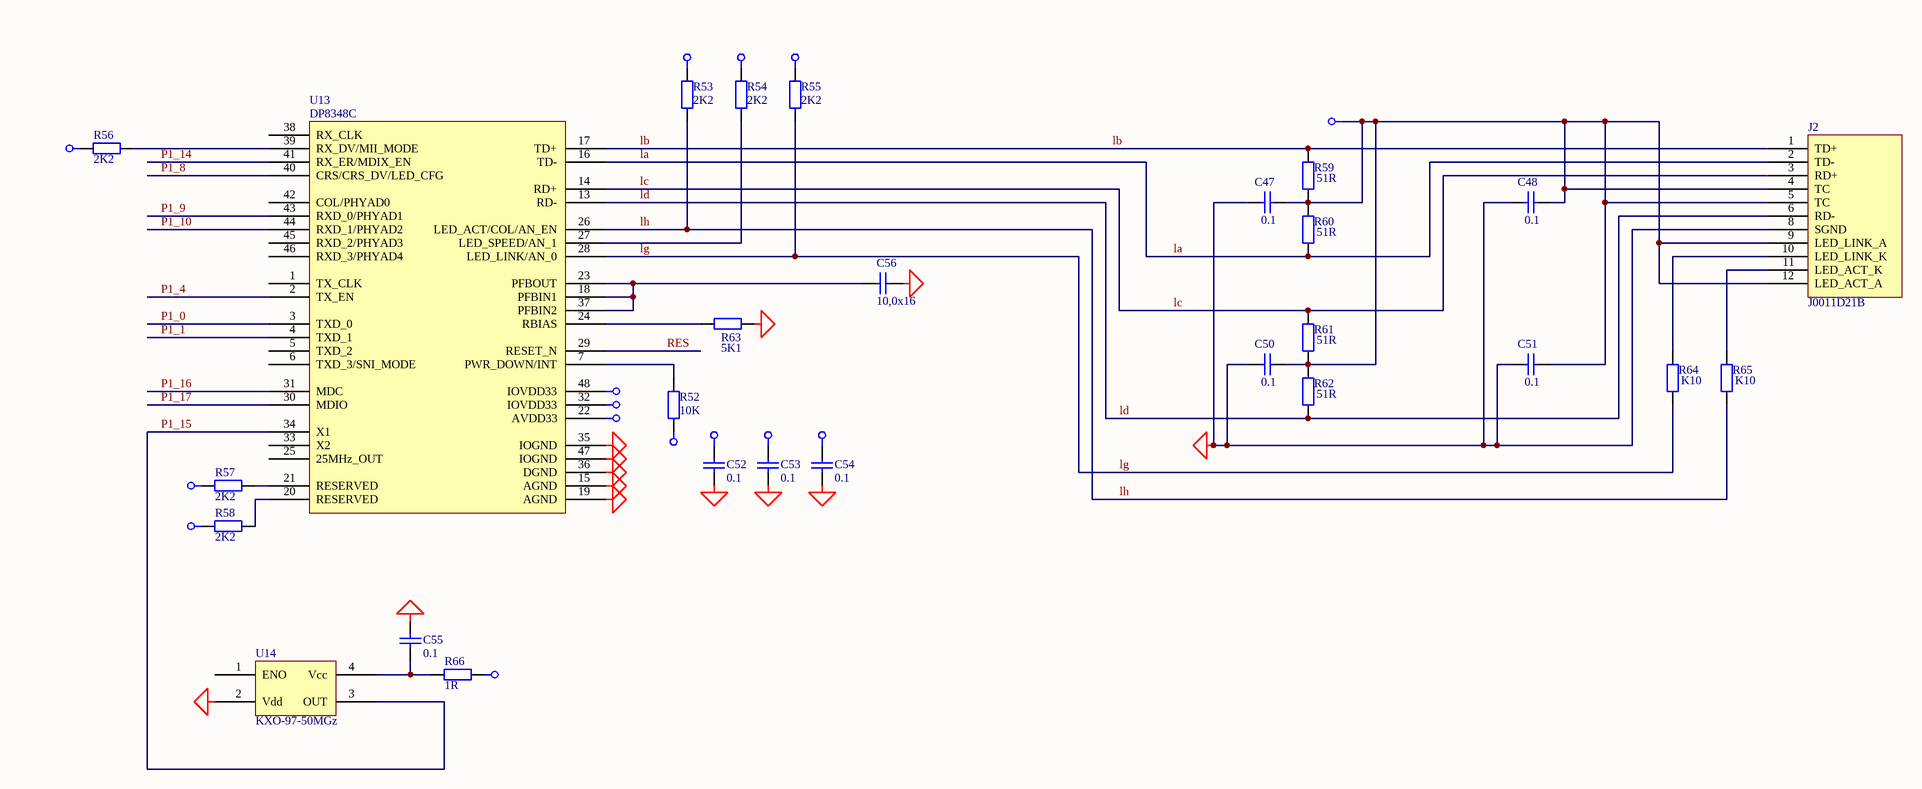
[diagram p3: UKU208_eth.SchDoc]

### Parts
C47  0.1  [_1206]
C48  0.1  [_1206]
C50  0.1  [_1206]
C51  0.1  [_1206]
C52  0.1  [_1206]
C53  0.1  [_1206]
C54  0.1  [_1206]
C55  0.1  [_1206]
C56  10,0x16  [_1206]
J2  J0011D21B  [J0011D21B]
R52  10K  [_1206]
R53  2K2  [_1206]
R54  2K2  [_1206]
R55  2K2  [_1206]
R56  2K2  [_1206]
R57  2K2  [_1206]
R58  2K2  [_1206]
R59  51R  [_1206]
R60  51R  [_1206]
R61  51R  [_1206]
R62  51R  [_1206]
R63  5K1  [_1206]
R64  K10  [_1206]
R65  K10  [_1206]
R66  1R  [_1206]
U13  DP8348C  [F-QFP7X7-G48/N]
U14  KXO-97-50MGz  [KXO-97]

### Nets
+3v3: C47.2 C48.2 C50.2 C51.2 C52.1 C53.1 C54.1 J2.4(TC) J2.5(TC) J2.9(LED_LINK_A) J2.12(LED_ACT_A) R52.2 R53.2 R54.2 R55.2 R56.2 R57.2 R58.2 R59.2 R60.1 R61.2 R62.1 U13.22(AVDD33) U13.32(IOVDD33) U13.48(IOVDD33)
+5v: R66.2
GND: C47.1 C48.1 C50.1 C51.1 C52.2 C53.2 C54.2 C55.2 C56.2 J2.8(SGND) R63.1 U13.15(AGND) U13.19(AGND) U13.35(IOGND) U13.36(DGND) U13.47(IOGND) U14.2(Vdd)
la: J2.2(TD-) R60.2 U13.16(TD-)
lb: J2.1(TD+) R59.1 U13.17(TD+)
lc: J2.3(RD+) R61.1 U13.14(RD+)
ld: J2.6(RD-) R62.2 U13.13(RD-)
lg: R55.1 R64.2 U13.28(LED_LINK/AN_0)
lh: R53.1 R65.2 U13.26(LED_ACT/COL/AN_EN)
P1_0: U13.3(TXD_0)
P1_1: U13.4(TXD_1)
P1_4: U13.2(TX_EN)
P1_8: U13.40(CRS/CRS_DV/LED_CFG)
P1_9: U13.43(RXD_0/PHYAD1)
P1_10: U13.44(RXD_1/PHYAD2)
P1_14: U13.41(RX_ER/MDIX_EN)
P1_15: U13.34(X1) U14.3(OUT)
P1_16: U13.31(MDC)
P1_17: U13.30(MDIO)
RES: U13.29(RESET_N)
NetC55_1: C55.1 R66.1 U14.4(Vcc)
NetC56_1: C56.1 U13.18(PFBIN1) U13.23(PFBOUT) U13.37(PFBIN2)
NetJ2_10: J2.10(LED_LINK_K) R64.1
NetJ2_11: J2.11(LED_ACT_K) R65.1
NetR52_1: R52.1 U13.7(PWR_DOWN/INT)
NetR54_1: R54.1 U13.27(LED_SPEED/AN_1)
NetR56_1: R56.1 U13.39(RX_DV/MII_MODE)
NetR57_1: R57.1 U13.21(RESERVED)
NetR58_1: R58.1 U13.20(RESERVED)
NetR63_2: R63.2 U13.24(RBIAS)

Not connected (* = marked no-connect by the designer): U13 1(TX_CLK) 5(TXD_2) 6(TXD_3/SNI_MODE) 25(25MHz_OUT) 33(X2) 38(RX_CLK) 42(COL/PHYAD0) 45(RXD_2/PHYAD3) 46(RXD_3/PHYAD4); U14 1(ENO)

### Library data of the parts
C47 C48 C50-C56 = Cap Semi: as C12 on sheet UKU208_main; Published: 8-Jun-2000; Revision: July-2002: Re-released for DXP Platform.; Publisher: Altium Limited; Class II: Capacitor
R52 = Res2: as R1 on sheet UKU208_main; Published: 8-Jun-2000; Revision: July-2002: Re-released for DXP Platform.; Publisher: Altium Limited; Class II: Resistor; Value: 10K
R53-R58 R63 R66 = Res2: Resistor; Manufacturer: Generic Components; Class I: Passive; Value: 10K; Rule: Undefined; Published: 8-Jun-2000; Revision: July-2002: Re-released for DXP Platform.; Publisher: Altium Limited; Class II: Resistor
R59-R62 R64 R65 = Res2: Resistor; Manufacturer: Generic Components; Class I: Passive; Value: 30; Rule: Undefined; Published: 8-Jun-2000; Revision: July-2002: Re-released for DXP Platform.; Publisher: Altium Limited; Class II: Resistor
U14 = KXO-97

## Nets that join several sheets
+3v3: UKU208_main (R17.2), UKU208_power_board (C41.1 C42.1 U10.2 U10.4), UKU208_cpu (12 pins), UKU208_eth (25 pins)
+5v: UKU208_main (20 pins), UKU208_power_board (C29.1 L1.2 U10.3), UKU208_cpu (9 pins), UKU208_eth (R66.2)
+Vbat: UKU208_power_board (BT1.1), UKU208_cpu (U1.19)
GND: UKU208_main (25 pins), UKU208_power_board (14 pins), UKU208_cpu (23 pins), UKU208_eth (17 pins)
P0_0: UKU208_main (U6.6), UKU208_cpu (U1.46)
P0_1: UKU208_main (U6.3), UKU208_cpu (U1.47)
P0_2: UKU208_main (U4.12), UKU208_cpu (U1.98)
P0_3: UKU208_main (U4.14), UKU208_cpu (U1.99)
P0_10: UKU208_main (U7.6), UKU208_cpu (U1.48)
P0_11: UKU208_main (U7.3), UKU208_cpu (U1.49)
P0_22: UKU208_main (R4.1), UKU208_cpu (U1.56)
P1_0: UKU208_cpu (U1.95), UKU208_eth (U13.3)
P1_1: UKU208_cpu (U1.94), UKU208_eth (U13.4)
P1_4: UKU208_cpu (U1.93), UKU208_eth (U13.2)
P1_8: UKU208_cpu (U1.92), UKU208_eth (U13.40)
P1_9: UKU208_cpu (U1.91), UKU208_eth (U13.43)
P1_10: UKU208_cpu (U1.90), UKU208_eth (U13.44)
P1_14: UKU208_cpu (U1.89), UKU208_eth (U13.41)
P1_15: UKU208_cpu (U1.88), UKU208_eth (U13.34 U14.3)
P1_16: UKU208_cpu (U1.87), UKU208_eth (U13.31)
P1_17: UKU208_cpu (U1.86), UKU208_eth (U13.30)
P1_26: UKU208_main (C17.2 U6.5), UKU208_cpu (U1.40)
P1_27: UKU208_main (U6.4), UKU208_cpu (U1.43)
P1_28: UKU208_main (C18.2 U7.5), UKU208_cpu (U1.44)
P1_29: UKU208_main (U7.4), UKU208_cpu (U1.45)
P2_7: UKU208_main (R7.1), UKU208_cpu (U1.66)
P2_8: UKU208_main (R6.1), UKU208_cpu (U1.65)
P2_9: UKU208_main (R5.1), UKU208_cpu (U1.64)
P2_10: UKU208_main (R17.1 U5.4), UKU208_cpu (U1.53)
P2_11: UKU208_main (R3.1), UKU208_cpu (U1.52)
P2_12: UKU208_main (R2.1), UKU208_cpu (U1.51)
P2_13: UKU208_main (R1.1), UKU208_cpu (U1.50)
RES: UKU208_main (D10.1), UKU208_cpu (U1.17), UKU208_eth (U13.29)